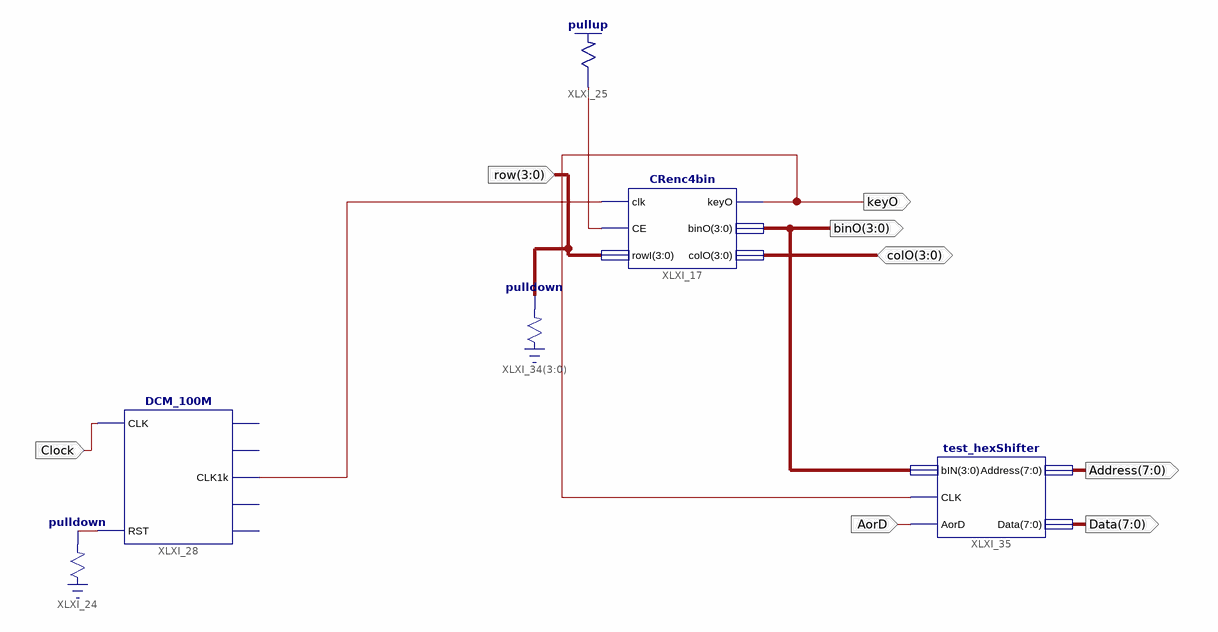
[diagram p0: schematic sheet 1]
// Xilinx ISE schematic KEYPAD_noShift.sch (spartan3e) as structural Verilog: 6 symbols, 8 ports
module KEYPAD_noShift (
  input  Clock,
  input  [3:0] row,
  input  AorD,
  inout  [3:0] colO,
  output keyO,
  output [3:0] binO,
  output [7:0] Address,
  output [7:0] Data
);

  wire XLXN_43, XLXN_44, XLXN_57;

  \pulldown  XLXI_24 (.O(XLXN_43));
  DCM_100M XLXI_28 (.CLK(Clock), .RST(XLXN_43), .CLK1k(XLXN_57));  // open: CLK1M, CLK10k, CLK100, CLK1
  \pulldown  XLXI_34[3:0] (.O(row));
  \pullup  XLXI_25 (.O(XLXN_44));
  CRenc4bin XLXI_17 (.clk(XLXN_57), .CE(XLXN_44), .rowI(row), .keyO(keyO), .binO(binO), .colO(colO));
  test_hexShifter XLXI_35 (.bIN(binO), .CLK(keyO), .AorD(AorD), .Address(Address), .Data(Data));
endmodule
